# EAGLE schematic 11-1121-2 ABC GPIO RELAY (EAGLE 9.6.2)
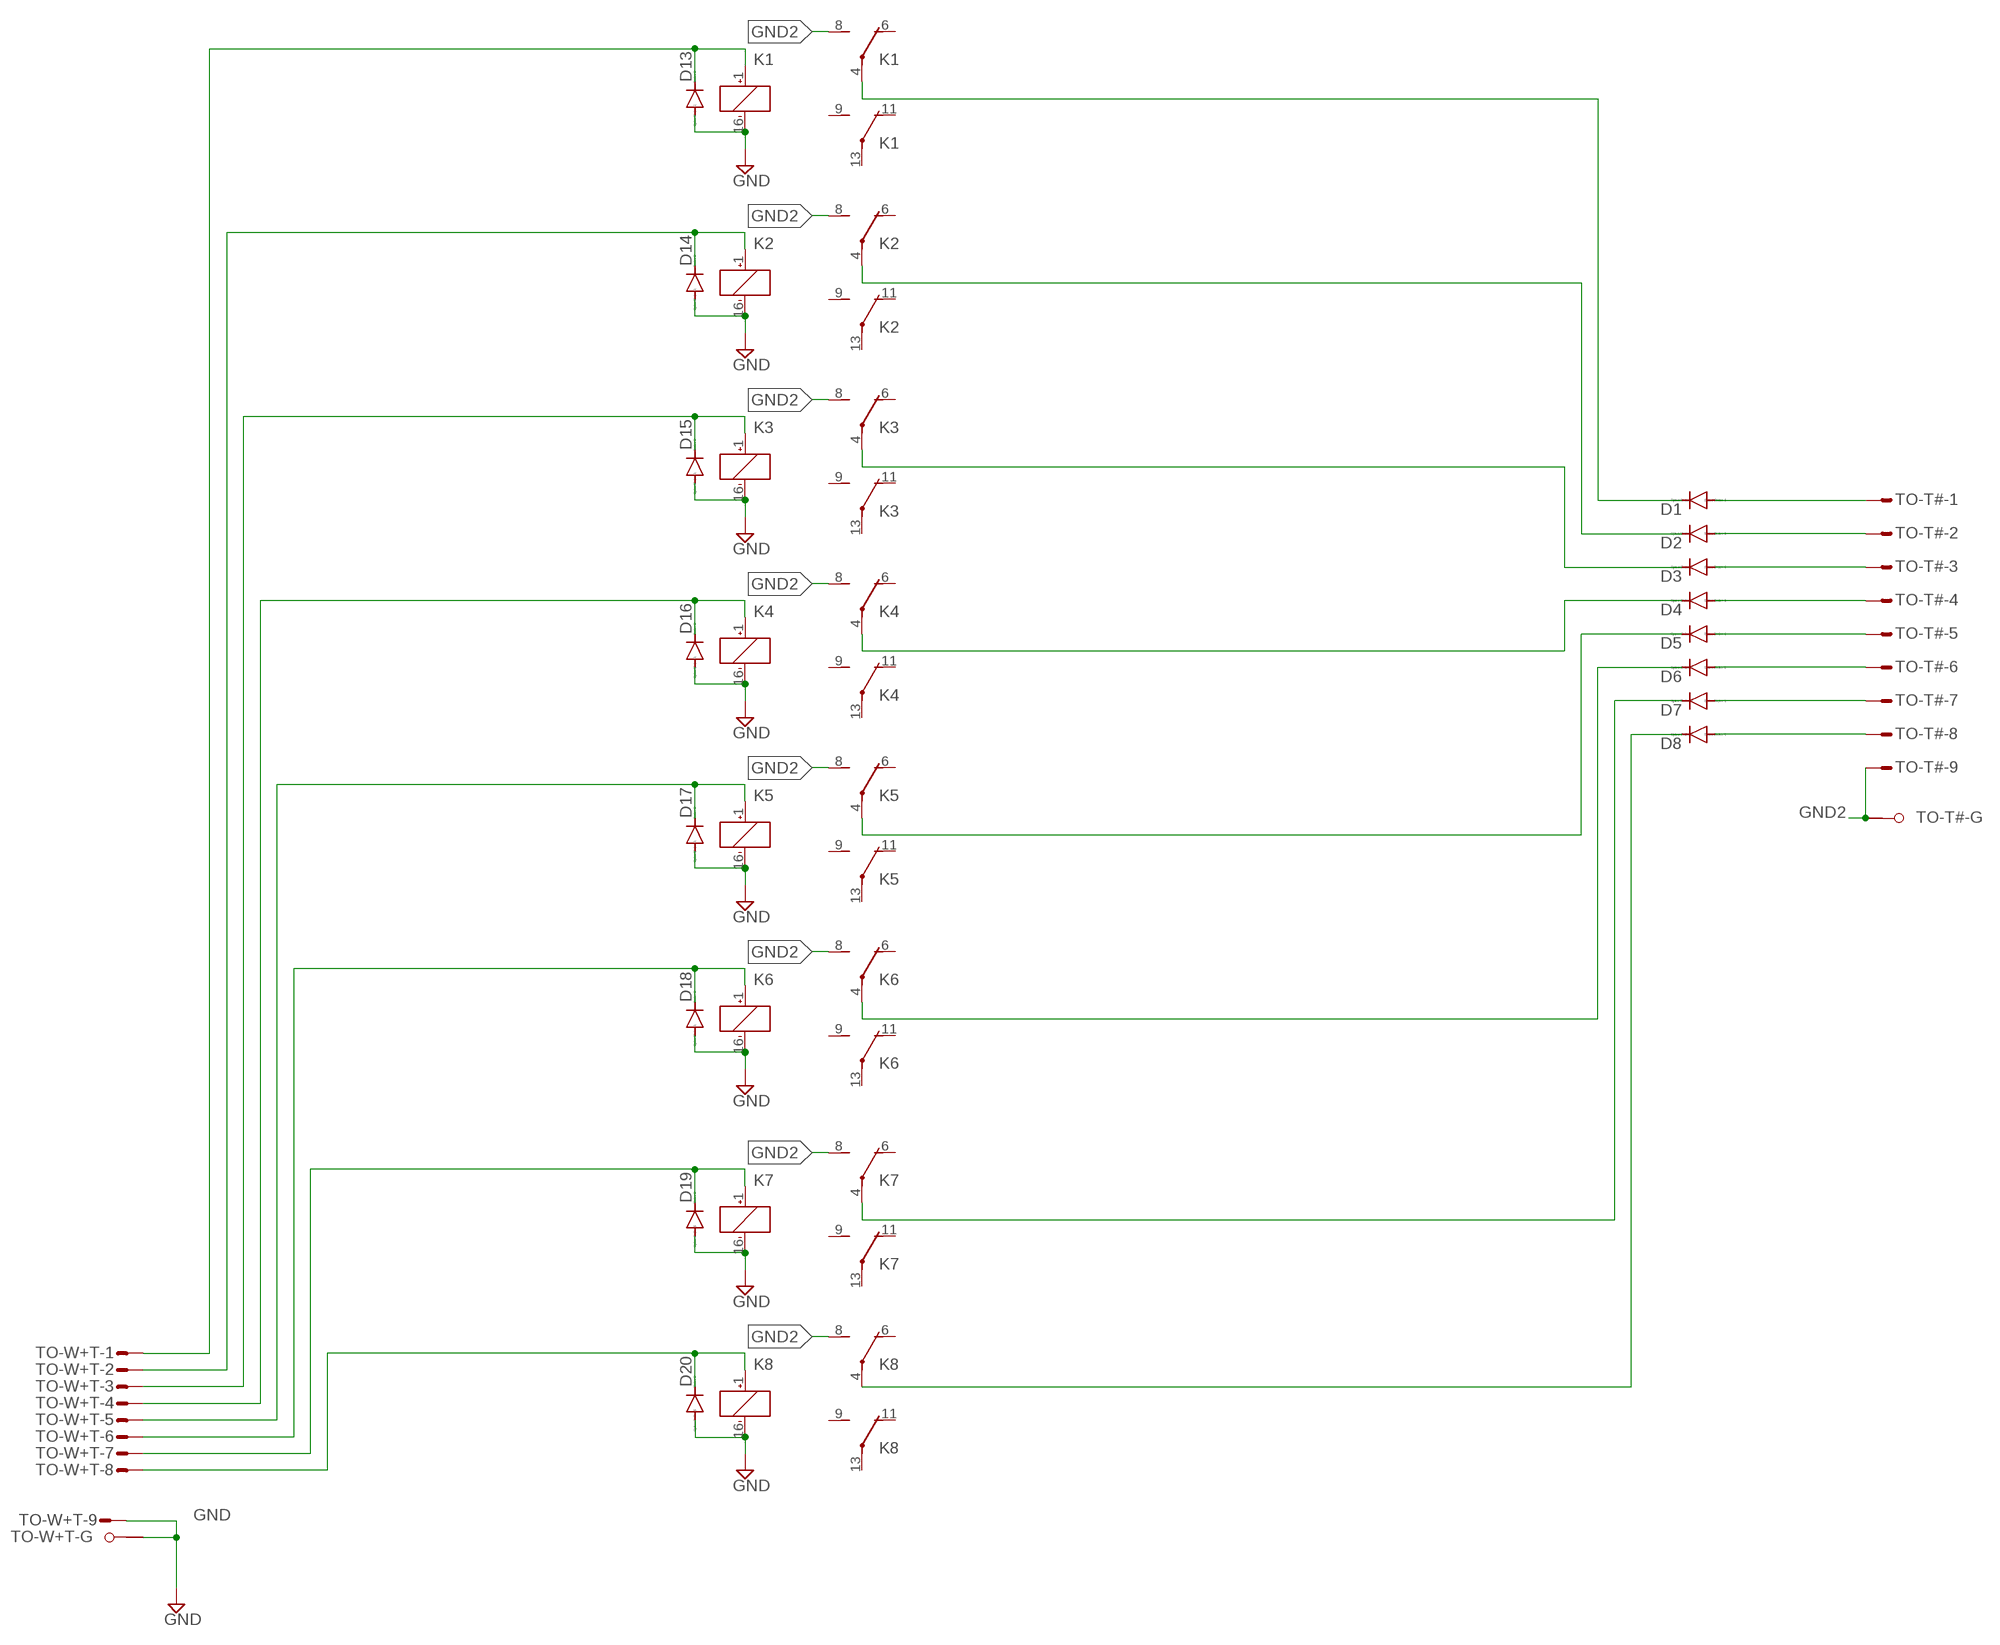
[diagram p0: schematic, sheet 1]

## Parts
D1  DIODE-DO214AA  [DO214AA]
D2  DIODE-DO214AA  [DO214AA]
D3  DIODE-DO214AA  [DO214AA]
D4  DIODE-DO214AA  [DO214AA]
D5  DIODE-DO214AA  [DO214AA]
D6  DIODE-DO214AA  [DO214AA]
D7  DIODE-DO214AA  [DO214AA]
D8  DIODE-DO214AA  [DO214AA]
D13  DIODE-DO214AA  [DO214AA]
D14  DIODE-DO214AA  [DO214AA]
D15  DIODE-DO214AA  [DO214AA]
D16  DIODE-DO214AA  [DO214AA]
D17  DIODE-DO214AA  [DO214AA]
D18  DIODE-DO214AA  [DO214AA]
D19  DIODE-DO214AA  [DO214AA]
D20  DIODE-DO214AA  [DO214AA]
K1  DS2Y-S-DC12V  [DS2Y]
K2  DS2Y-S-DC12V  [DS2Y]
K3  DS2Y-S-DC12V  [DS2Y]
K4  DS2Y-S-DC12V  [DS2Y]
K5  DS2Y-S-DC12V  [DS2Y]
K6  DS2Y-S-DC12V  [DS2Y]
K7  DS2Y-S-DC12V  [DS2Y]
K8  DS2Y-S-DC12V  [DS2Y]
TO-T#  M09HPS  [M09HP]
TO-W+T  M09HPS  [M09HP]

## Nets
GND: D13.A D14.A D15.A D16.A D17.A D18.A D19.A D20.A K1.16(1:-) K2.16(1:-) K3.16(1:-) K4.16(1:-) K5.16(1:-) K6.16(1:-) K7.16(1:-) K8.16(1:-) TO-W+T.9(-9:M) TO-W+T.G1(-G:G1)
GND2: K1.8(2:S) K2.8(2:S) K3.8(2:S) K4.8(2:S) K5.8(2:S) K6.8(2:S) K7.8(2:S) K8.8(2:S) TO-T#.9(-9:M) TO-T#.G1(-G:G1)
N$1: D13.C K1.1(1:+) TO-W+T.1(-1:M)
N$2: D1.A TO-T#.1(-1:M)
N$3: D2.A TO-T#.2(-2:M)
N$4: D3.A TO-T#.3(-3:M)
N$5: D4.A TO-T#.4(-4:M)
N$6: D5.A TO-T#.5(-5:M)
N$7: D6.A TO-T#.6(-6:M)
N$8: D7.A TO-T#.7(-7:M)
N$9: D8.A TO-T#.8(-8:M)
N$10: D14.C K2.1(1:+) TO-W+T.2(-2:M)
N$11: D15.C K3.1(1:+) TO-W+T.3(-3:M)
N$12: D16.C K4.1(1:+) TO-W+T.4(-4:M)
N$13: D17.C K5.1(1:+) TO-W+T.5(-5:M)
N$14: D18.C K6.1(1:+) TO-W+T.6(-6:M)
N$15: D19.C K7.1(1:+) TO-W+T.7(-7:M)
N$16: D20.C K8.1(1:+) TO-W+T.8(-8:M)
N$17: D1.C K1.4(2:P)
N$19: D2.C K2.4(2:P)
N$21: D3.C K3.4(2:P)
N$23: D4.C K4.4(2:P)
N$25: D5.C K5.4(2:P)
N$26: D6.C K6.4(2:P)
N$27: D7.C K7.4(2:P)
N$29: D8.C K8.4(2:P)
Unconnected: K1.6(2:O) K1.9(3:S) K1.11(3:O) K1.13(3:P) K2.6(2:O) K2.9(3:S) K2.11(3:O) K2.13(3:P) K3.6(2:O) K3.9(3:S) K3.11(3:O) K3.13(3:P) K4.6(2:O) K4.9(3:S) K4.11(3:O) K4.13(3:P) K5.6(2:O) K5.9(3:S) K5.11(3:O) K5.13(3:P) K6.6(2:O) K6.9(3:S) K6.11(3:O) K6.13(3:P) K7.6(2:O) K7.9(3:S) K7.11(3:O) K7.13(3:P) K8.6(2:O) K8.9(3:S) K8.11(3:O) K8.13(3:P) TO-T#.G2(-G:G2) TO-W+T.G2(-G:G2)

## Library data of the parts
D1-D8 D13-D20 = diode:DIODE-: DIODE
K1-K8 = relay:DS2Y-S-DC*: MINIATURE RELAY NAiS Source: http://www.mew-europe.com/.. en_ds_61005_0023.pdf; MPN: DS2Y-S-DC12V; OC_FARNELL: unknown; OC_NEWARK: 13P3261
TO-T# TO-W+T = con-subd:M09HPS: SUB-D; OC_FARNELL: unknown; OC_NEWARK: unknown